# EAGLE design ChillerPower (EAGLE 7.3.0)
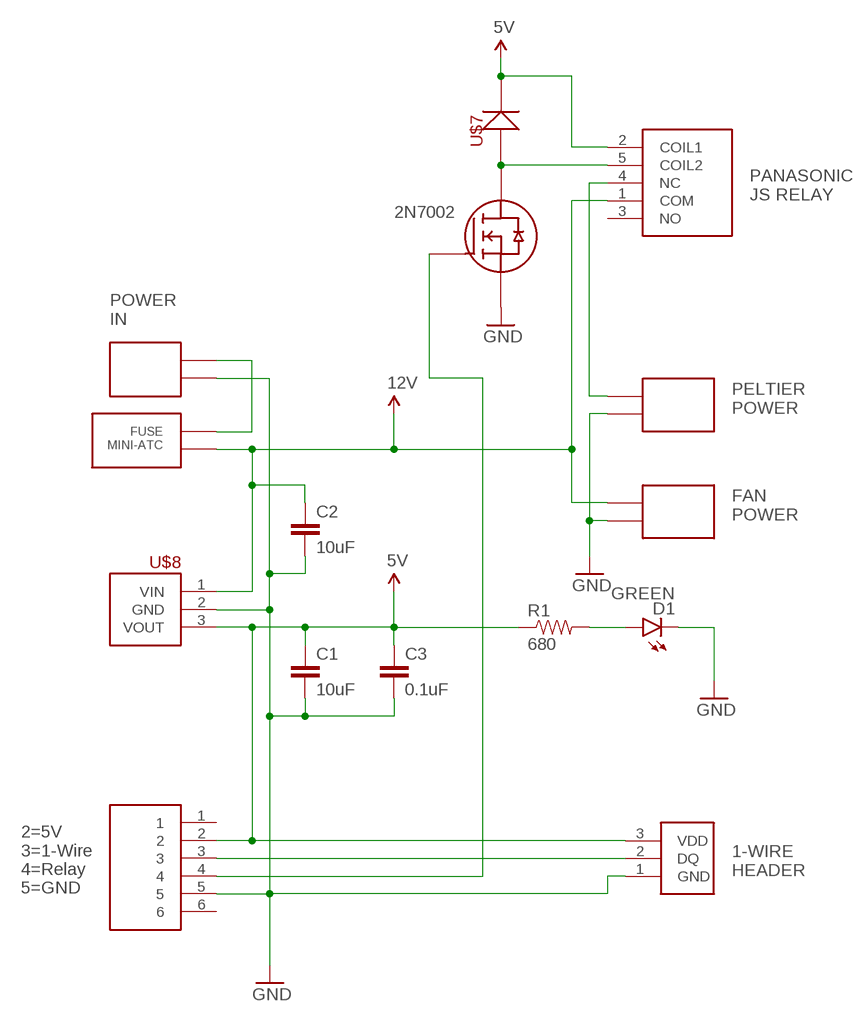
[diagram p0: schematic, sheet 1]

## Parts
C1  10uF  CAP-10UF-0603  [0603-CAP]
C2  10uF  CAP-10UF-0603  [0603-CAP]
C3  0.1uF  CAP-0.1UF-0603  [0603-CAP]
D1  GREEN  LED-GREEN0603  [LED-0603]
J1  MODULAR-JACK-6P6C-1  [MODULAR-JACK-6P6C-1]
Q1  2N7002L  [2N7002L]
R1  680  RES-680-0805  [0805]
U$1  FUSE-HOLDER-MINI-BLADE  [FUSE-HOLDER-MINI-BLADE]
U$2  TERMBLOCK-2X3.5MM  [TERMBLOCK-2X3.5MM]
U$3  RELAY-PANASONIC-JS  [RELAY-PANASONIC-JS]
U$4  TERMBLOCK-2X3.5MM  [TERMBLOCK-2X3.5MM]
U$5  TERMBLOCK-2X3.5MM  [TERMBLOCK-2X3.5MM]
U$6  TERMBLOCK-1WIRE  [TERMBLOCK-1WIRE]
U$7  DIODE-BAS21  [DIODE-BAS21]
U$8  REG-R-78E  [REG-R-78E]

## Nets
5V: C1.1 C3.1 J1.2 R1.1 U$3.2(COIL1) U$6.3(VDD) U$7.3(CA) U$8.3(VOUT)
12V: C2.1 U$1.2 U$1.3 U$3.1(COM) U$5.1 U$8.1(VIN)
GND: C1.2 C2.2 C3.2 D1.C J1.5 Q1.2 U$2.2 U$4.2 U$5.2 U$6.1(GND) U$8.2(GND)
N$2: U$1.1 U$1.4 U$2.1
N$3: Q1.3 U$3.5(COIL2) U$7.1(AN)
N$4: J1.3 U$6.2(DQ)
N$5: U$3.4(NC) U$4.1
N$7: J1.4 Q1.1
N$8: D1.A R1.2
Unconnected: J1.1 J1.6 U$3.3(NO)

## Notes on the sheet
- PANASONIC
  JS RELAY
- 2N7002
- POWER
  IN
- PELTIER
  POWER
- FAN
  POWER
- 1-WIRE
  HEADER
- 2=5V
  3=1-Wire
  4=Relay
  5=GND

## Library data of the parts
C1 C2 = rickk2:CAP-10UF-0603: CAP CER 10UF 16V X5R 0805 $ 0.21 https://www.digikey.com/product-detail/en/murata-electronics-north-america/GRM21BR61C106KE15L/490-3886-1-ND/965928
C3 = rickk2:CAP-0.1UF-0603: CAP CER 0.1UF 16V X7R 0603 https://www.digikey.com/product-detail/en/murata-electronics-north-america/GRM188R71C104KA01D/490-1532-1-ND/587771
D1 = rickk2:LED-GREEN: Lite-On LTST-C193KGKT-5A Green 572nm LED Indication - Discrete 2V 5 mA 0603 https://www.digikey.com/product-detail/en/lite-on-inc/LTST-C193KGKT-5A/160-1828-1-ND/2356247 Res = 270 ohm @ 3.3V, Res = 680 ohm 1/8W @ 5V
J1 = rickk2:MODULAR-JACK-6P6C-1: CONN MOD JACK 6P6C R/A UNSHLD $0.77 Stewart Connector SS-7066-NF Jack Modular Connector 6p6c (RJ11, RJ12, RJ14, RJ25) 90° Angle (Right) Unshielded Cat5 https://www.digikey.com/product-detail/en/stewart-connector/SS-7066-NF/380-1043-ND/388305
Q1 = rickk2:2N7002L: MOSFET N-CH 60V 0.115A SOT-23 $ 0.16 On Semicondutor 2N7002LT1G N-Channel 115mA (Tc) 225mW (Ta) Surface Mount SOT-23-3 (TO-236) https://www.digikey.com/product-detail/en/on-semiconductor/2N7002LT1G/2N7002LT1GOSCT-ND/917791
R1 = rickk2:RES-680-0805: RES SMD 680 OHM 5% 1/8W 0805 $0.10 Panasonic ERJ-6GEYJ681V ±5% 0.125W, 1/8W Chip Resistor 0805 (2012 Metric) Automotive AEC-Q200 Thick Film https://www.digikey.com/product-detail/en/panasonic-electronic-components/ERJ-6GEYJ681V/P680ACT-ND/90033
U$1 = rickk2:FUSE-HOLDER-MINI-BLADE: Mini ATC/ATO fuse holder $0.98 FUSE HOLDER BLADE 500V 20A PCB Keystone 3568 https://www.digikey.com/product-detail/en/keystone-electronics/3568/36-3568-ND/2137306
U$2 U$4 U$5 = rickk2:TERMBLOCK-2X3.5MM
U$3 = rickk2:RELAY-PANASONIC-JS: RELAY GEN PURPOSE SPDT 10A 5V $1.63 General Purpose Relay SPDT (1 Form C) 5VDC Coil Through Hole 72 mA @ 5V, 3.5V turn-on, 0.5V turn-off 10A @ 250VAC, 100 VDC max https://www.digikey.com/product-detail/en/panasonic-electric-works/JS1-5V-F/255-2064-ND/1242012
U$6 = rickk2:TERMBLOCK-1WIRE: TERM BLOCK 3.5MM VERT 3POS PCB $1.00 3 Position Wire to Board Terminal Block Horizontal with Board 0.138" (3.50mm) Through Hole 10A 16-26 AWG Top screw, vertical, blue https://www.digikey.com/product-detail/en/on-shore-technology-inc/OSTTE030161/ED2636-ND/614585
U$7 = rickk2:DIODE-BAS21: Diodes Incorporated BAS21-7-F $ 0.14 http://www.digikey.com/product-detail/en/BAS21-7-F/BAS21-FDICT-ND/717813 Surface mount SOT-23-3
U$8 = rickk2:REG-R-78E: CONV DC/DC 5V 500MA OUT THRU 7508 compatible pinout $ 2.84 Input voltage: Min 7V, Max 28V 500 mA max https://www.digikey.com/product-detail/en/recom-power/R-78E5.0-0.5/945-1648-5-ND/2834904 CAP CER 10UF 16V X5R 0805 $ 0.21 https://www.digikey.com/product-detail/en/murata-electronics-north-america/GRM21BR61C106KE15L/490-3886-1-ND/965928 CAP CER 0.1UF 16V X7R 0603 https://www.digikey.com/product-detail/en/murata-electronics-north-america/GRM188R71C104KA01D/490-1532-1-ND/587771

## Board
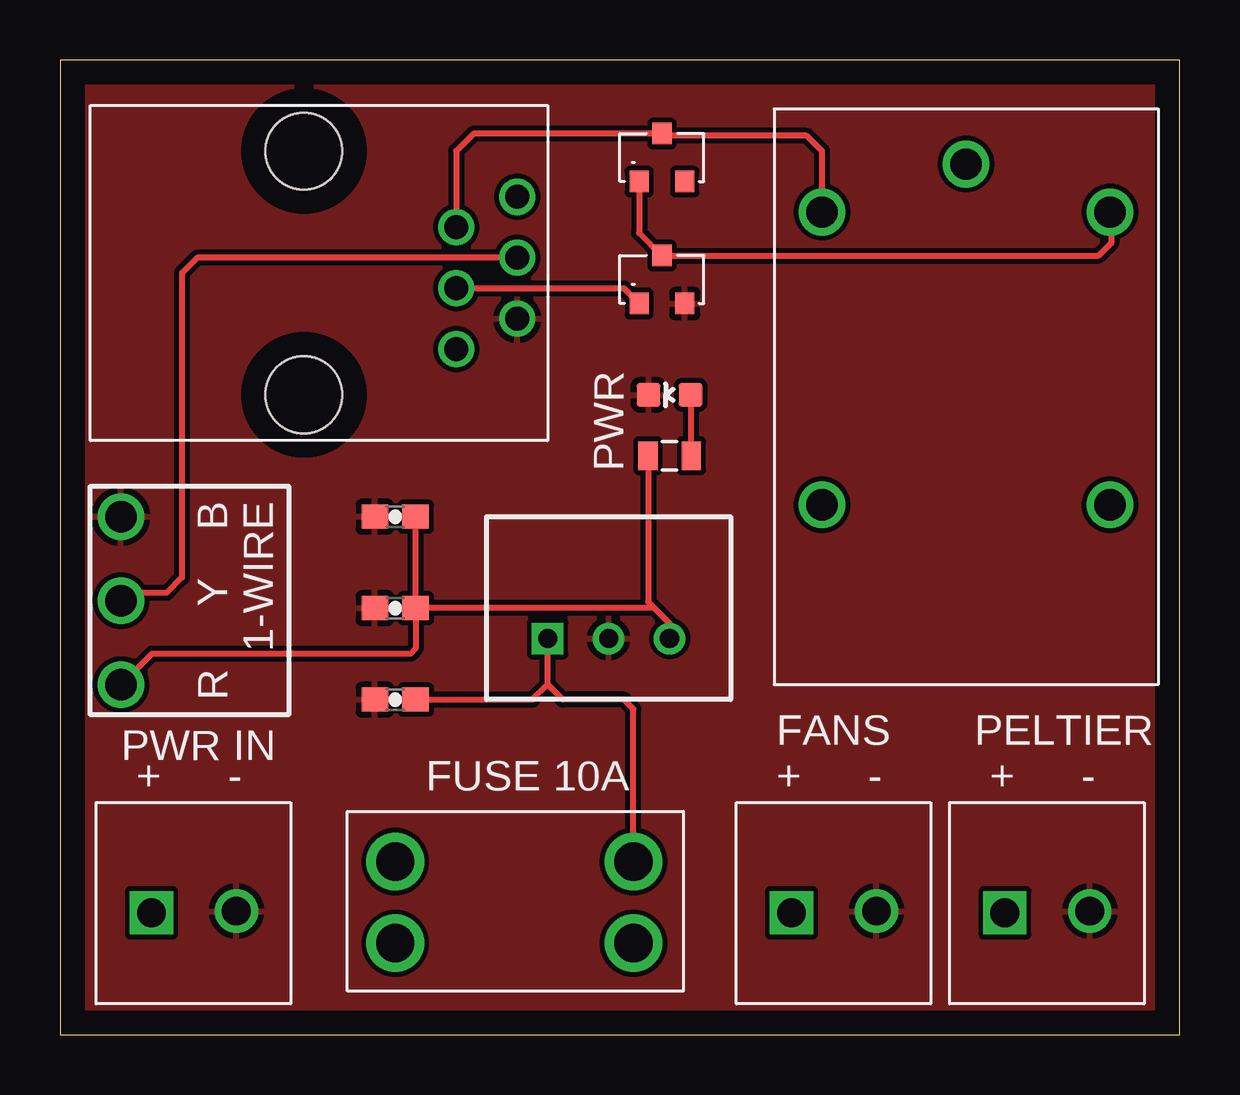
[diagram p1: board, top side]
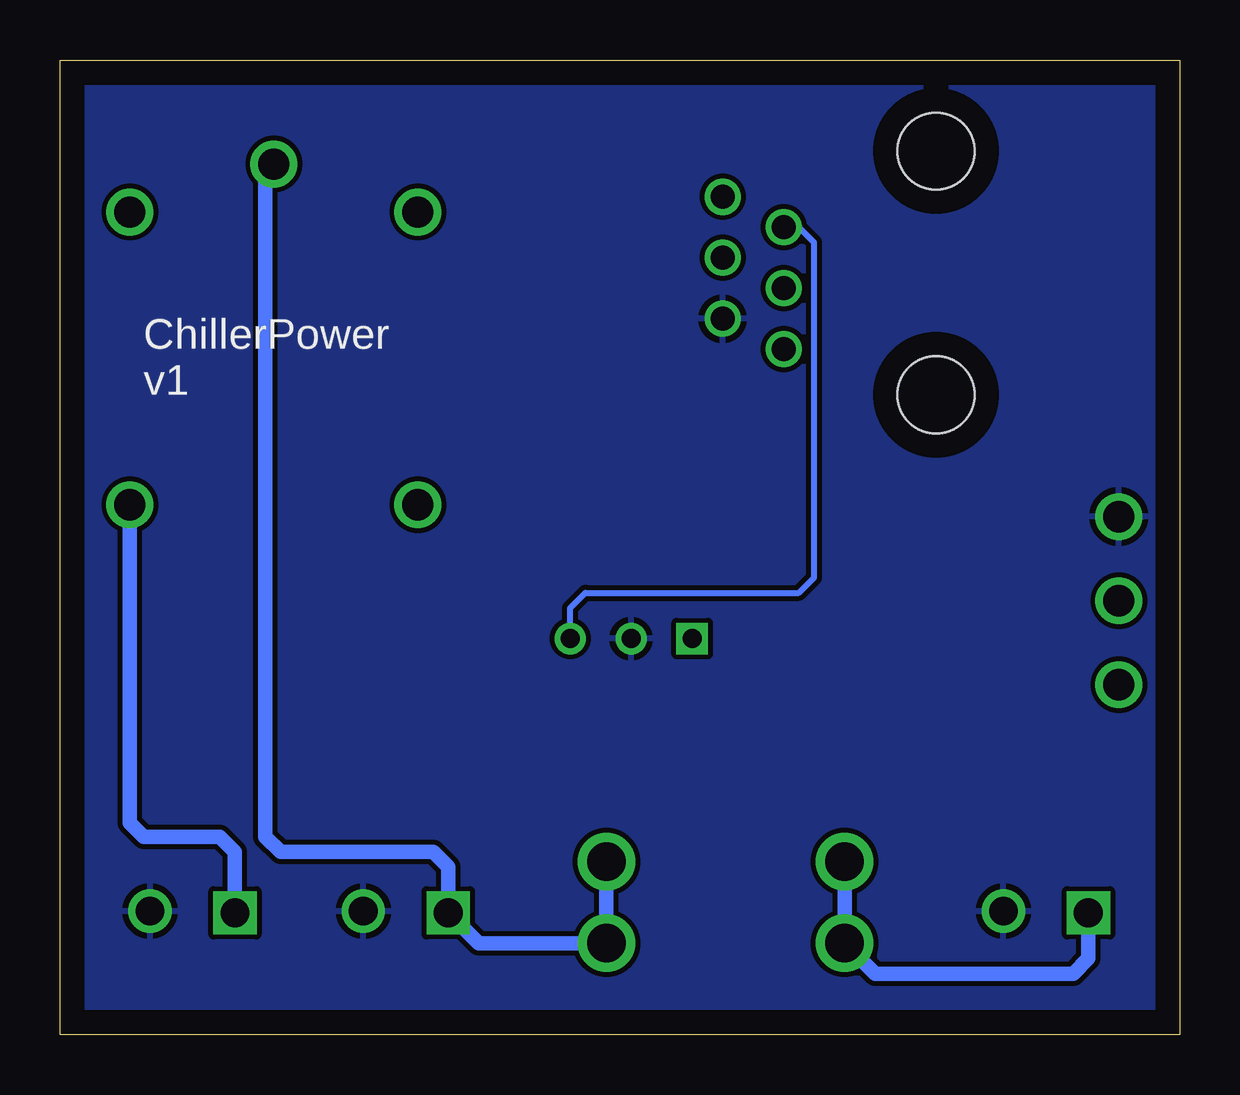
[diagram p2: board, bottom side, seen from below]

Size 46.66 x 40.63 mm. Coordinates in mm from the lower left corner, seen from the top.
Outline: 0,0 46.66,0 46.66,40.63 0,40.63 0,0
Copper layers (1*16): Top 0.035mm / dielectric 1.5mm / Bottom 0.035mm
Design rules "default": minimum track width 10mil, minimum drill 24mil, track to track 8mil, track to pad 8mil, pad to pad 8mil, via to via 8mil, smd to smd 8mil, copper to edge 40mil, drill to drill 8mil, minimum pad ring 10mil, minimum via ring 8mil, stop-mask expansion 4mil, vias tented up to drill 0mil, thermal gap 10mil

### Footprints (pad centres in the part's own frame; a part is rotated, then mirrored left to right if it is on the bottom)
0603-CAP = smd 1.1 x 1: 1 -0.85,0; 2 0.85,0
LED-0603 = smd 1 x 1: A 0,-0.877; C 0,0.877
MODULAR-JACK-6P6C-1 = drill 1: 1 1.905,8.89; 2 3.175,6.35; 3 4.445,8.89; 4 5.715,6.35; 5 6.985,8.89; 6 8.255,6.35 | hole 3.2: 0,0; 10.16,0
2N7002L = smd 0.8 x 0.9: 1 0,0; 2 1.9,0; 3 0.95,2
0805 = smd 0.8 x 1.2: 1 -0.9,0; 2 0.9,0
FUSE-HOLDER-MINI-BLADE = drill 1.6: 1 0,0; 2 9.92,0; 3 9.92,3.4; 4 0,3.4
TERMBLOCK-2X3.5MM = drill 1.2 square: 1 0,0 | drill 1.2: 2 3.54,0.07
RELAY-PANASONIC-JS = drill 1.3: 1 -2,6; 2 0,0; 3 12.2,0; 4 12.2,12; 5 0,12
TERMBLOCK-1WIRE = drill 1.3: 1 0,0; 2 3.5,0; 3 7,0
DIODE-BAS21 = smd 0.8 x 0.9: 1 0,0; 2 1.9,0; 3 0.95,2
REG-R-78E = drill 0.8 square: 1 -2.54,0 | drill 0.8: 2 0,0; 3 2.54,0

### Placement (x,y rotation side)
C1  13.97,21.59 180 top
C2  13.97,13.97 180 top
C3  13.97,17.78 180 top
D1  25.4,26.67 90 top
J1  10.16,36.83 270 top
Q1  24.13,30.48 0 top
R1  25.4,24.13 0 top
U$1  13.97,3.81 0 top
U$2  3.81,5.08 0 top
U$3  31.75,34.29 270 top
U$4  39.37,5.08 0 top
U$5  30.48,5.08 0 top
U$6  2.54,21.59 270 top
U$7  24.13,35.56 0 top
U$8  22.86,16.51 0 top

### Tracks (layer width: path | path; a pad name or v marks a point on that pad's centre or on a via)
5V
  Top 0.254: U$8.3 25.4,17.14 24.77,17.78 | 24.77,17.78 C3.1 | C3.1 C1.1 | C3.1 14.82,16.09 14.61,15.88 3.83,15.88 U$6.3 | U$3.2 31.75,36.83 31.11,37.47 25.18,37.47 U$7.3 17.24,37.56 16.51,36.83 J1.2 | R1.1 24.5,18.05 24.77,17.78
  Bottom 0.254: U$8.3 25.4,17.78 24.77,18.41 15.88,18.41 15.24,19.05 15.24,33.02 15.88,33.66 J1.2
12V
  Top 0.254: C2.1 19.68,13.97 20.32,14.61 | 20.32,14.61 U$8.1 | U$1.3 23.89,13.57 23.5,13.97 20.95,13.97 20.32,14.61
  Bottom 0.61: U$1.3 U$1.2 29.21,3.81 U$5.1 30.48,6.99 31.11,7.62 37.47,7.62 38.1,8.26 38.1,35.94 U$3.1
GND
  pour Top: 0,0 0,40.64 46.99,40.64 46.99,0
  pour Bottom: 0,0 0,40.64 46.99,40.64 46.99,0
N$2
  Bottom 0.61: U$2.1 3.81,3.17 4.45,2.54 12.7,2.54 U$1.1 U$1.4
N$3
  Top 0.254: U$7.1 24.13,33.43 Q1.3 43.27,32.48 43.81,33.02 43.81,34.23 U$3.5
N$4
  Top 0.254: J1.3 5.71,32.38 5.08,31.75 5.08,19.05 4.45,18.41 2.87,18.41 U$6.2
N$5
  Bottom 0.61: U$3.4 43.75,8.82 43.18,8.26 40.01,8.26 39.37,7.62 U$4.1
N$7
  Top 0.254: J1.4 23.5,31.11 Q1.1
N$8
  Top 0.254: R1.2 26.3,26.65 D1.A

### Text on the board
tPlace: PWR | FANS | PELTIER | PWR IN | + | - | FUSE 10A | + | - | + | -
bPlace: ChillerPower / v1
Document: BAS21 | 2N7002 | PANASONIC / JS 10A